# Altium project silovaya_SAUVC26.PrjPcb
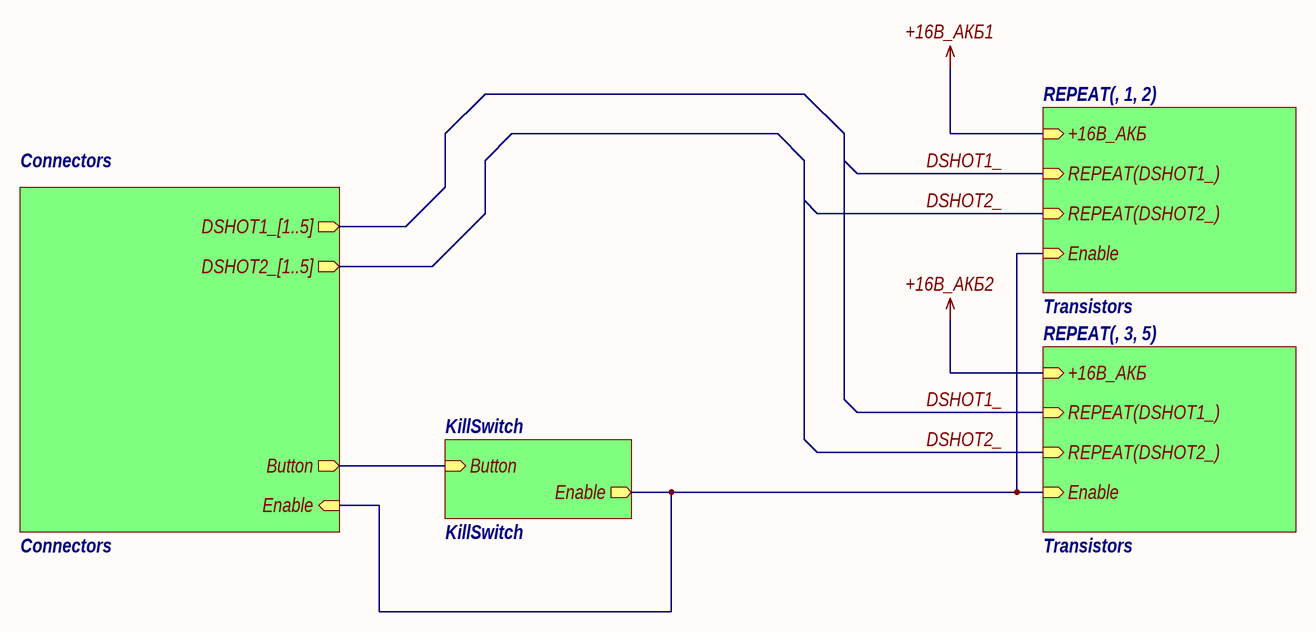
[diagram p0: Main.SchDoc]
4 sheets, 93 parts. Net scope: hierarchical (ports join the sheet entries above them; power ports are global).
Board file: Powerboard_SAUVC26.PcbDoc
Sheets:
  Main.SchDoc
    Connectors = Connectors.SchDoc
    KillSwitch = KillSwitch.SchDoc
    1 = Transistors.SchDoc
    2 = Transistors.SchDoc
    3 = Transistors.SchDoc
    4 = Transistors.SchDoc
    5 = Transistors.SchDoc

## Sheet Main.SchDoc
size 420 x 297 mm; SheetNumber: 1; SheetTotal: 4

### Sub-sheets
Connectors = Connectors: DSHOT1_[1..5] (out), DSHOT2_[1..5] (out), Button (out), Enable (in)
KillSwitch = KillSwitch: Button (in), Enable (out)
REPEAT(, 1, 2) = Transistors: REPEAT(DSHOT1_) (in), REPEAT(DSHOT2_) (in), Enable (in), +16В_АКБ (in)
REPEAT(, 3, 5) = Transistors: REPEAT(DSHOT1_) (in), REPEAT(DSHOT2_) (in), Enable (in), +16В_АКБ (in)

### Nets
Button: sheet Connectors/Button, sheet KillSwitch/Button
DSHOT1_: sheet REPEAT(, 1, 2)/REPEAT(DSHOT1_), sheet REPEAT(, 3, 5)/REPEAT(DSHOT1_)
DSHOT2_: sheet REPEAT(, 1, 2)/REPEAT(DSHOT2_), sheet REPEAT(, 3, 5)/REPEAT(DSHOT2_)
ENABLE: sheet Connectors/Enable, sheet KillSwitch/Enable, sheet REPEAT(, 1, 2)/Enable, sheet REPEAT(, 3, 5)/Enable

### Notes on the sheet
- Перв. примен.
- Справ. №
- Подп. и дата
- Инв. № дубл.
- Взам. инв. №
- Разраб.
- Изм.
- Лист
- № докум.
- Подп.
- Дата
- Лит.
- Масса
- Масштаб
- Пров.
- Т.контр.
- Схема электрическая принципиальная
- Листов
- Инв. № подл.
- Утв.
- Н.контр.
- Копировал
- Формат А3

## Sheet Connectors.SchDoc
size 594 x 420 mm; SheetNumber: 2; SheetTotal: 4
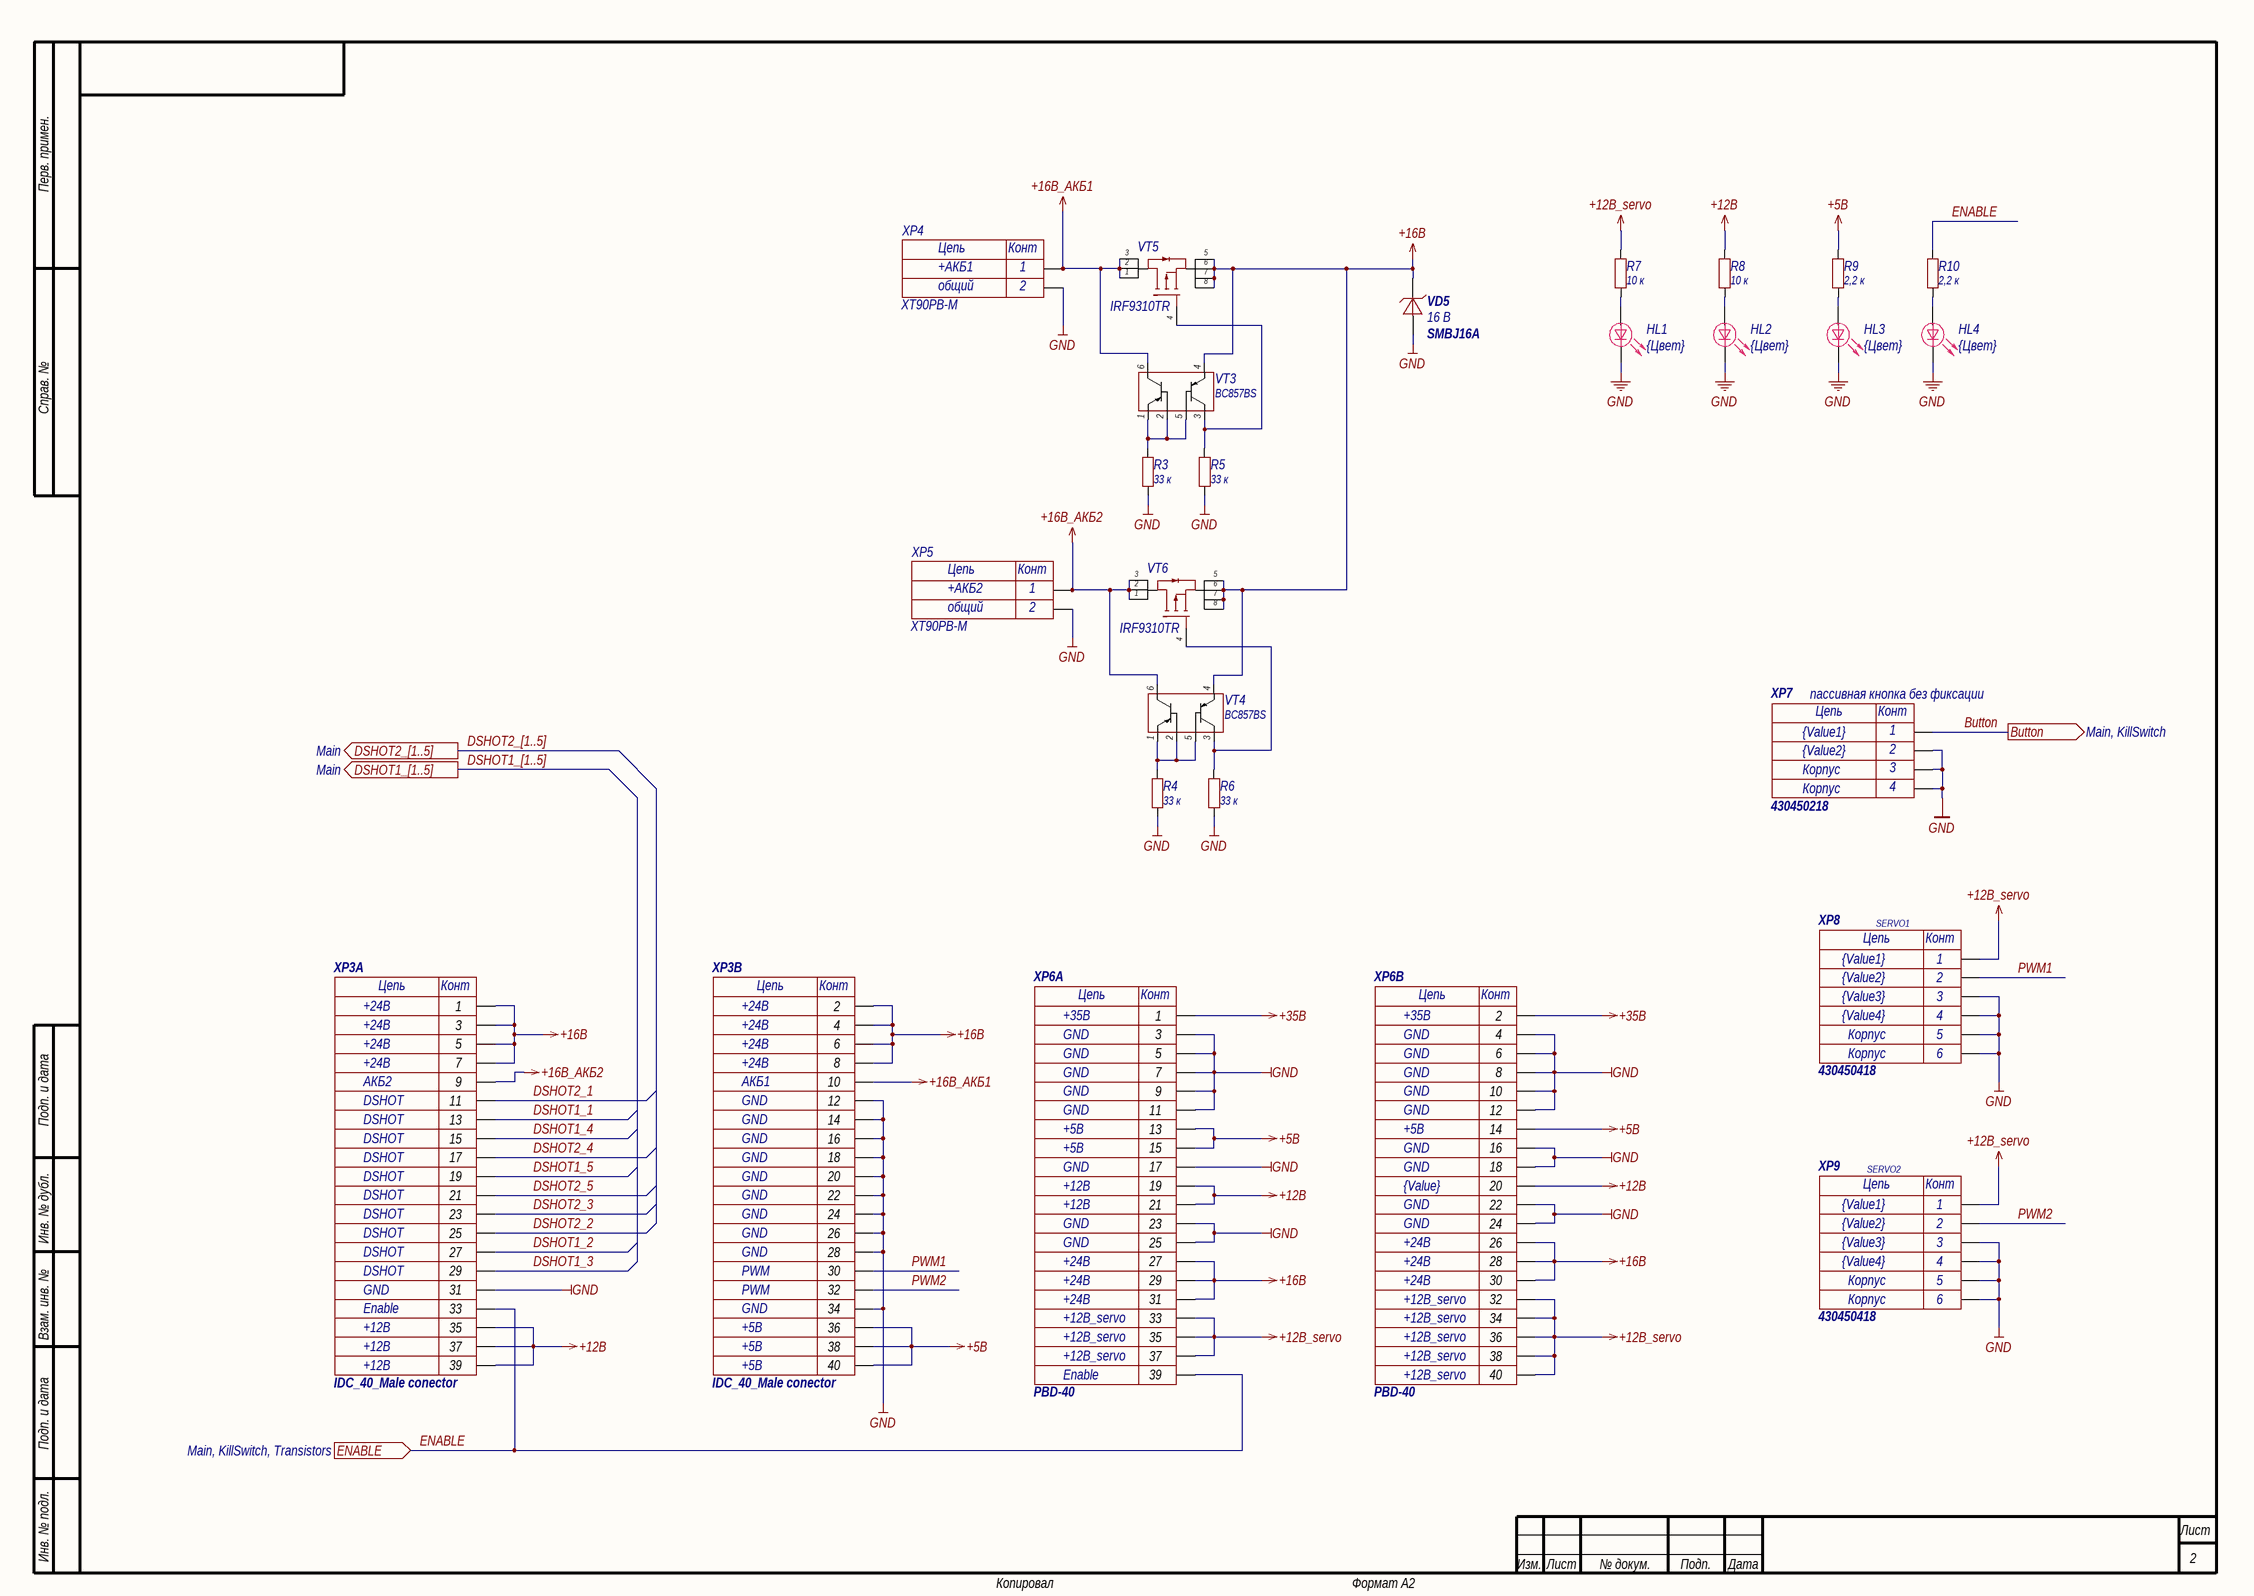
[diagram p1: Connectors.SchDoc]

### Parts
HL1  Color: {Цвет}  [0805D]  (hidden comment: LED)
HL2  Color: {Цвет}  [0805D]  (hidden comment: LED)
HL3  Color: {Цвет}  [0805D]  (hidden comment: LED)
HL4  Color: {Цвет}  [0805D]  (hidden comment: LED)
R3  value 33 к  [0603R]  (hidden comment: Resistor)
R4  value 33 к  [0603R]  (hidden comment: Resistor)
R5  value 33 к  [0603R]  (hidden comment: Resistor)
R6  value 33 к  [0603R]  (hidden comment: Resistor)
R7  value 10 к  [0603R]  (hidden comment: Resistor)
R8  value 10 к  [0603R]  (hidden comment: Resistor)
R9  value 2,2 к  [0603R]  (hidden comment: Resistor)
R10  value 2,2 к  [0603R]  (hidden comment: Resistor)
VD5  SMBJ16A  value 16 В  [SMB]
VT3  BC857BS  [SOT-363_35um]
VT4  BC857BS  [SOT-363_35um]
VT5  IRF9310TR  [SOIC-8]
VT6  IRF9310TR  [SOIC-8]
XP3  IDC_40_Male conector  Value17: Enable  Value20: +12В  Value16: GND  Value15: DSHOT  Value5: АКБ2  Value1: +24В  [IDC_40_Male conector]  (parts A,B of 2)
XP4  XT90PB-M  Value2: общий  Value1: +АКБ1  [XT90PB-M]
XP5  XT90PB-M  Value2: общий  Value1: +АКБ2  [XT90PB-M]
XP6  PBD-40  Value17: +12В_servo  Value20: Enable  Value16: +24В  Value13: GND  Value11: +12В  Value8: +5В  Value1: +35В  [DCDC_SAUVC26]  (parts A,B of 2)
XP7  430450218  Value3: Корпус  Value2: {Value2}  Value1: {Value1}  [Molex_430450218]
XP8  430450418  Value1: {Value1}  Value2: {Value2}  Value3: {Value3}  Value4: {Value4}  [MOLEX_430450418]
XP9  430450418  Value1: {Value1}  Value2: {Value2}  Value3: {Value3}  Value4: {Value4}  [MOLEX_430450418]

### Ports
Button (out, see Main, KillSwitch), DSHOT1_[1..5] (out, see Main), DSHOT2_[1..5] (out, see Main), ENABLE (in, see Main, KillSwitch, Transistors)

### Nets
+5В: R9.2 XP3.36 XP3.38 XP3.40 XP6.13 XP6.14 XP6.15
+12В: R8.2 XP3.35 XP3.37 XP3.39 XP6.19 XP6.20 XP6.21
+12В_servo: R7.2 XP6.32 XP6.33 XP6.34 XP6.35 XP6.36 XP6.37 XP6.38 XP6.40 XP8.1 XP9.1
+16В: VD5.2 VT3.4 VT4.4 VT5.5 VT5.6 VT5.7 VT5.8 VT6.5 VT6.6 VT6.7 VT6.8 XP3.1 XP3.2 XP3.3 XP3.4 XP3.5 XP3.6 XP3.7 XP3.8 XP6.26 XP6.27 XP6.28 XP6.29 XP6.30 XP6.31
+16В_АКБ1: VT3.6 VT5.1 VT5.2 VT5.3 XP3.10 XP4.P
+16В_АКБ2: VT4.6 VT6.1 VT6.2 VT6.3 XP3.9 XP5.P
+35В: XP6.1 XP6.2
GND: HL1.2 HL2.2 HL3.2 HL4.2 R3.1 R4.1 R5.1 R6.1 VD5.1 XP3.12 XP3.14 XP3.16 XP3.18 XP3.20 XP3.22 XP3.24 XP3.26 XP3.28 XP3.31 XP3.34 XP4.N XP5.N XP6.3 XP6.4 XP6.5 XP6.6 XP6.7 XP6.8 XP6.9 XP6.10 XP6.11 XP6.12 XP6.16 XP6.17 XP6.18 XP6.22 XP6.23 XP6.24 XP6.25 XP7.0 XP7.2 XP8.0 XP8.3 XP8.4 XP9.0 XP9.3 XP9.4
Button: XP7.1 ; port Button
DSHOT1_1: XP3.13
DSHOT1_2: XP3.27
DSHOT1_3: XP3.29
DSHOT1_4: XP3.15
DSHOT1_5: XP3.19
DSHOT2_1: XP3.11
DSHOT2_2: XP3.25
DSHOT2_3: XP3.23
DSHOT2_4: XP3.17
DSHOT2_5: XP3.21
ENABLE: R10.2 XP3.33 XP6.39 ; port ENABLE
PWM1: XP3.30 XP8.2
PWM2: XP3.32 XP9.2
NetHL1_1: HL1.1 R7.1
NetHL2_1: HL2.1 R8.1
NetHL3_1: HL3.1 R9.1
NetHL4_1: HL4.1 R10.1
NetR3_2: R3.2 VT3.1 VT3.2 VT3.5
NetR4_2: R4.2 VT4.1 VT4.2 VT4.5
NetR5_2: R5.2 VT3.3 VT5.4
NetR6_2: R6.2 VT4.3 VT6.4

### Buses and harness runs
bus DSHOT1_[1..5] = port DSHOT1_[1..5]
bus DSHOT2_[1..5] = port DSHOT2_[1..5]

### Notes on the sheet
- (near XP7) пассивная кнопка без фиксации
- SERVO1
- SERVO2
- Перв. примен.
- Справ. №
- Подп. и дата
- Инв. № дубл.
- Взам. инв. №
- Инв. № подл.
- Изм.
- Лист
- № докум.
- Подп.
- Дата
- Копировал
- Формат А2
- (in symbol DCDC_SAUVC26, part A) Цепь; Конт
- (in symbol DCDC_SAUVC26, part B) Цепь; Конт
- (in symbol IDC_40_Male conector, part A) Цепь; Конт
- (in symbol IDC_40_Male conector, part B) Цепь; Конт
- (in symbol Molex_430450218) Цепь; Конт; 3; 4
- (in symbol Molex_430450418) Цепь; Конт; Корпус; 5; 6
- (in symbol XT90PB-M) Цепь; Конт; 1; 2

### Library data of the parts
HL1-HL4 = LED: Светодиод; Part Number: LED
R3-R6 = Resistor_33k_1_0603: Резистор номиналом 33 кОм и точностью 1%; Power: *; Part Number: Resistor_33k_1_0603; Tolerance: 1%
R7 R8 = Resistor_10k_1_0603: Резистор номиналом 10 кОм и точностью 1%; Power: *; Part Number: Resistor_10k_1_0603; Tolerance: 1%
R9 R10 = Resistor_2.2k_1_0603: Резистор номиналом 2,2 кОм и точностью 1%; Power: *; Part Number: Resistor_2.2k_1_0603; Tolerance: 1%
VD5 = SMBJ16A: Защитный диод на 16 В, рассеиваемая мощность 600 Вт; Voltage nominal (V): 16; Power (W): 600; Автор: glebmih; Part Number: SMBJ16A
VT3 VT4 = BC857BS: Сборка из биполярных транзисторов, 2 pnp, 45 В,  0.1А; Voltage (V): 45 В; Автор: glebmih; Part Number: BC857BS; Current (A): 0.1 А
VT5 VT6 = IRF9310TR: P-канальный MOSFET, 30 В, 20 А; Voltage (V): 30 В; Current (A): 20 А; Автор: glebmih; Part Number: IRF9310TR
XP3 = IDC_40_Male conector: IDC 40-пиновый разъём прямая вилка; System: Connector; Value19: +12В; Value18: +12В; Value14: DSHOT; Value13: DSHOT; Value12: DSHOT; Value11: DSHOT; Value10: DSHOT; Value9: DSHOT; Value8: DSHOT; Value7: DSHOT; Value6: DSHOT; Part Number: IDC_40_Male conector
XP4 XP5 = XT90PB-M: 90 А (60 продолжительно), 2 контакта, прямой отец; System: Connector; Part Number: XT90PB-M
XP6 = DCDC_SAUVC26: Плата DCDC преобрахователей; Value19: +12В_servo; Value18: +12В_servo; Value15: +24В; Value14: +24В; Value12: GND; Value10: +12В; Value9: GND; Value7: +5В; Value6: GND; Value5: GND; Value4: GND; Value3: GND; Value2: GND
XP7 = Molex_430450218: Разъем типа провод-плата, 3 мм, 2 контакт(-ов), Штыревой Разъем, Серия Micro-Fit для поверхностного монтажа; System: Connector; Value4: Корпус; Part Number: Molex_430450218
XP8 XP9 = Molex_430450418: Разъем типа провод-плата, 3 мм, 4 контакт(-ов), Штыревой Разъем, для поверностного монтажа; System: Connector; Part Number: Molex_430450418

## Sheet KillSwitch.SchDoc
size 420 x 297 mm; SheetNumber: 4; SheetTotal: 4
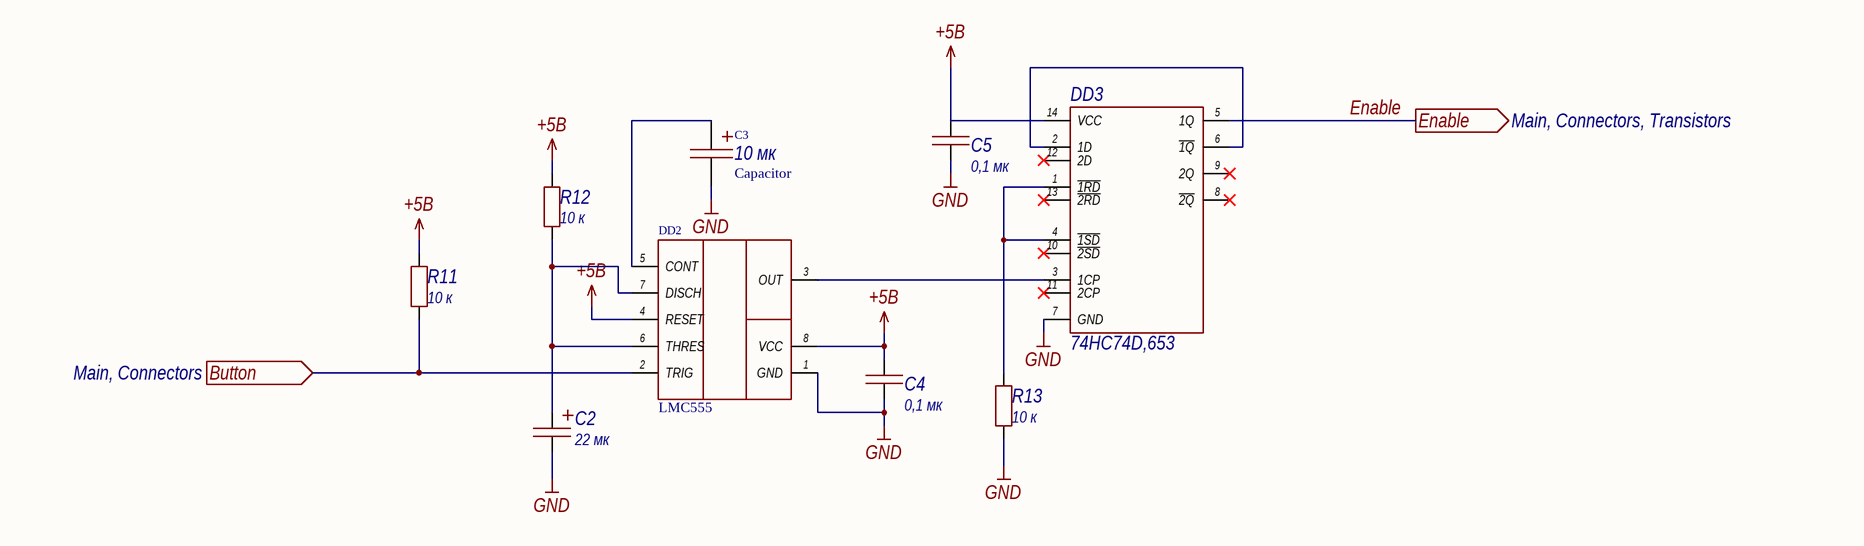
[diagram p2: KillSwitch.SchDoc]

### Parts
C2  value 22 мк  [TC_A]  (hidden comment: Capacitor)
C3  Capacitor  value 10 мк  [TC_A]
C4  value 0,1 мк  [0603C]  (hidden comment: Capacitor)
C5  value 0,1 мк  [0603C]  (hidden comment: Capacitor)
DD2  LMC555  [SOIC-8]
DD3  74HC74D,653  [SOIC-14]
R11  value 10 к  [0603R]  (hidden comment: Resistor)
R12  value 10 к  [0603R]  (hidden comment: Resistor)
R13  value 10 к  [0603R]  (hidden comment: Resistor)

### Ports
Button (in, see Main, Connectors), Enable (out, see Main, Connectors, Transistors)

### Nets
+5В: C4.2 C5.1 DD2.4(RESET) DD2.8(VCC) DD3.14(VCC) R11.2 R12.2
GND: C2.2 C3.2 C4.1 C5.2 DD2.1(GND) DD3.7(GND) R13.1
Button: DD2.2(TRIG) R11.1 ; port Button
ENABLE: DD3.5(1Q) ; port Enable
NetC2_1: C2.1 DD2.6(THRES) DD2.7(DISCH) R12.1
NetC3_1: C3.1 DD2.5(CONT)
NetDD2_3: DD2.3(OUT) DD3.3(1CP)
NetDD3_1: DD3.1(~{1RD}) DD3.4(~{1SD}) R13.2
NetDD3_2: DD3.2(1D) DD3.6(~{1Q})

Not connected (* = marked no-connect by the designer): DD3 8(~{2Q})* 9(2Q)* 10(~{2SD})* 11(2CP)* 12(2D)* 13(~{2RD})*

### Notes on the sheet
- Перв. примен.
- Справ. №
- Подп. и дата
- Инв. № дубл.
- Взам. инв. №
- Инв. № подл.
- Изм.
- Лист
- № докум.
- Подп.
- Дата
- Копировал
- Формат А3

### Library data of the parts
C2 = Capacitor_22u_10_50V_TC_A: Танталовый конденсатор; Tolerance: 0,1; Voltage (V): 50; Type: Tantalum; Capacity (uF): 22; Part Number: Capacitor_22u_10_50V_TC_A
C3 = Capacitor_10u_10_50V_TC_A: Танталовый конденсатор; Tolerance: 0,1; Voltage (V): 50; Type: Tantalum; Capacity (uF): 10; Part Number: Capacitor_10u_10_50V_TC_A
C4 C5 = Capacitor_0,1u_10_50V_X7R_0603C: Конденсатор; Library Path2: Schematic\Capacitor.SchLib; Tolerance: 0,1; Voltage (V): 50; Dielectric: X7R; Capacity (nF): 100; Part Number: Capacitor_0,1u_10_50V_X7R_0603C
DD2 = LMC555: Таймер интегральный прецизионный КМОП; Part Number: LMC555
DD3 = 74HC74D,653: Два триггера D-типа; MF: Nexperia USA; SnapEDA_Link: https://www.snapeda.com/parts/74HC74D,653/Nexperia/view-part/?ref=snap; Package: SO14-14 Nexperia USA Inc.; Value: *; MP: 74HC74D,653; Check_prices: https://www.snapeda.com/parts/74HC74D,653/Nexperia/view-part/?ref=eda; Part Number: 74HC74D,653
R11-R13 = Resistor_10k_1_0603: Резистор номиналом 10 кОм и точностью 1%; Power: *; Part Number: Resistor_10k_1_0603; Tolerance: 1%

## Sheet Transistors.SchDoc
size 420 x 297 mm; SheetNumber: 3; SheetTotal: 4
Used 5 times, as channels 1, 2, 3, 4, 5. Parts and nets are listed once, with the designators drawn on the sheet.
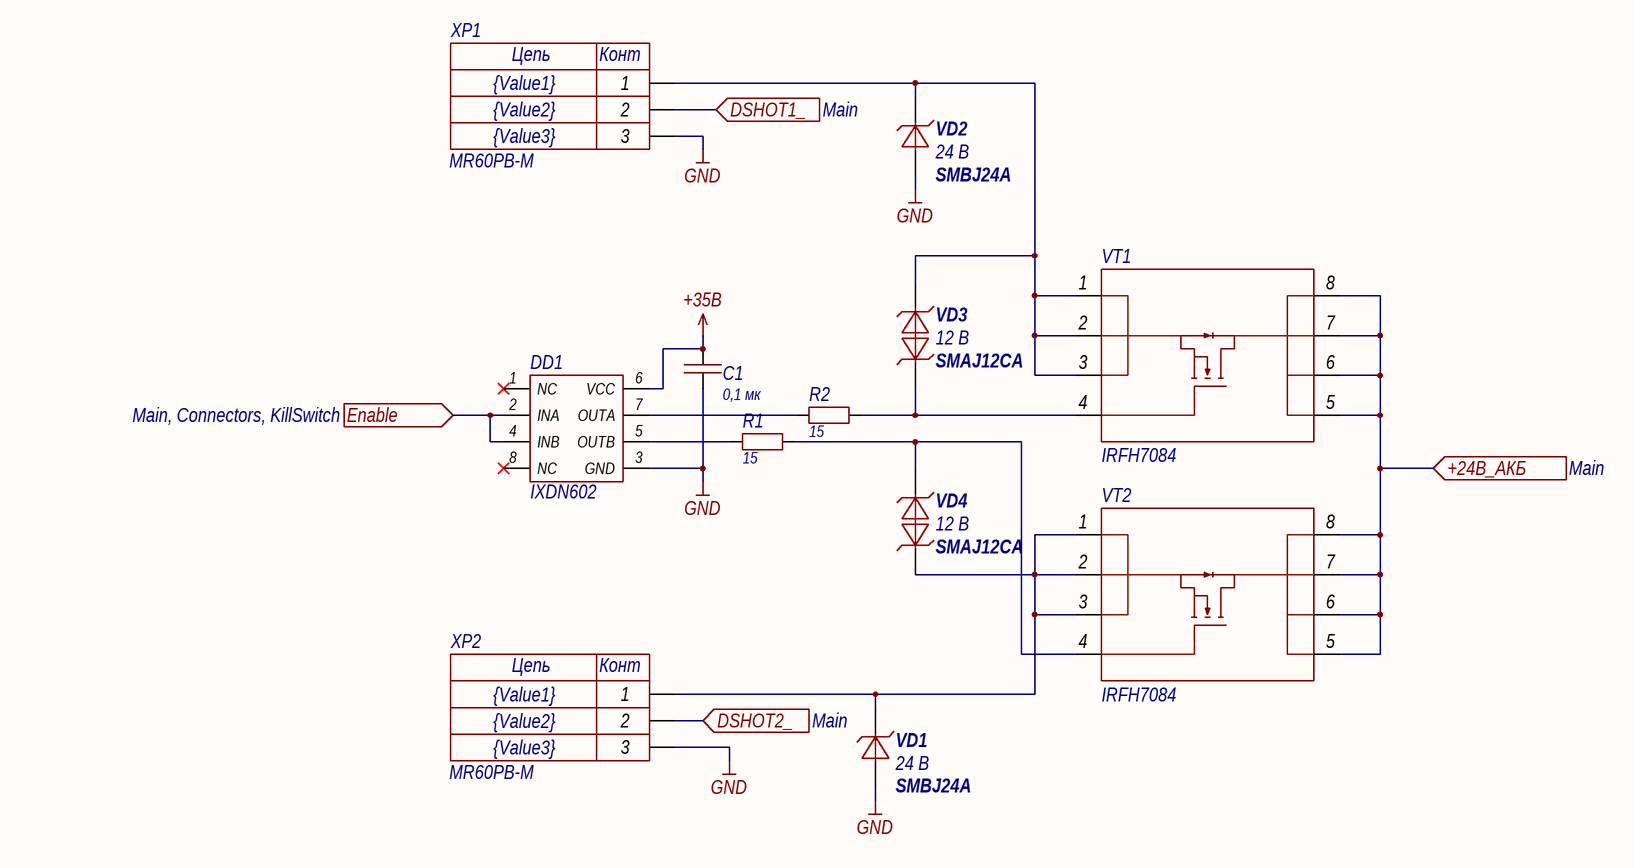
[diagram p3: Transistors.SchDoc]

### Parts
C1  value 0,1 мк  [0603C]  (hidden comment: Capacitor)
DD1  IXDN602  [SOIC-8]
R1  value 15  [0603R]  (hidden comment: Resistor)
R2  value 15  [0603R]  (hidden comment: Resistor)
VD1  SMBJ24A  value 24 В  [SMB]
VD2  SMBJ24A  value 24 В  [SMB]
VD3  SMAJ12CA  value 12 В  [SMA]
VD4  SMAJ12CA  value 12 В  [SMA]
VT1  IRFH7084  [PQFN_5x6]
VT2  IRFH7084  [PQFN_5x6]
XP1  MR60PB-M  Value3: {Value3}  Value2: {Value2}  Value1: {Value1}  [MR60PB-M]
XP2  MR60PB-M  Value3: {Value3}  Value2: {Value2}  Value1: {Value1}  [MR60PB-M]

### Ports
+24В_АКБ (in, see Main), DSHOT1_ (in, see Main), DSHOT2_ (in, see Main), Enable (in, see Main, Connectors, KillSwitch)

### Nets
+35В: C1.2 DD1.6(VCC)
GND: C1.1 DD1.3(GND) VD1.1 VD2.1 XP1.3 XP2.3
+24В_АКБ: VT1.5 VT1.6 VT1.7 VT1.8 VT2.5 VT2.6 VT2.7 VT2.8 ; port +24В_АКБ
DSHOT1_: XP1.2 ; port DSHOT1_
DSHOT2_: XP2.2 ; port DSHOT2_
Enable: DD1.2(INA) DD1.4(INB) ; port Enable
NetDD1_5: DD1.5(OUTB) R1.1
NetDD1_7: DD1.7(OUTA) R2.1
NetR1_2: R1.2 VD4.2 VT2.4
NetR2_2: R2.2 VD3.1 VT1.4
NetVD1_2: VD1.2 VD4.1 VT2.1 VT2.2 VT2.3 XP2.1
NetVD2_2: VD2.2 VD3.2 VT1.1 VT1.2 VT1.3 XP1.1

Not connected (* = marked no-connect by the designer): DD1 1(NC)* 8(NC)*

### Channels
1: designators end in _1; ports +24В_АКБ=NetVT1_1_5 DSHOT1_=DSHOT1_1 DSHOT2_=DSHOT2_1 Enable=ENABLE
2: designators end in _2; ports +24В_АКБ=NetVT1_2_5 DSHOT1_=DSHOT1_2 DSHOT2_=DSHOT2_2 Enable=ENABLE
3: designators end in _3; ports +24В_АКБ=NetVT1_3_5 DSHOT1_=DSHOT1_3 DSHOT2_=DSHOT2_3 Enable=ENABLE
4: designators end in _4; ports +24В_АКБ=NetVT1_4_5 DSHOT1_=DSHOT1_4 DSHOT2_=DSHOT2_4 Enable=ENABLE
5: designators end in _5; ports +24В_АКБ=NetVT1_5_5 DSHOT1_=DSHOT1_5 DSHOT2_=DSHOT2_5 Enable=ENABLE

### Notes on the sheet
- Перв. примен.
- Справ. №
- Подп. и дата
- Инв. № дубл.
- Взам. инв. №
- Инв. № подл.
- Изм.
- Лист
- № докум.
- Подп.
- Дата
- Копировал
- Формат А3
- (in symbol MR60PB-M) Цепь; Конт

### Library data of the parts
C1 = Capacitor_0,1u_10_50V_X7R_0603C: as C4 on sheet KillSwitch; Part Number: Capacitor_0,1u_10_50V_X7R_0603C
DD1 = IXDN602: Двухканальный драйвер затвора для mosfet и igbt транзисторов; Part Number: IXDN602
R1 R2 = Resistor_15_1_0603: Резистор номиналом 15 Ом 1%; Power: *; Part Number: Resistor_15_1_0603; Tolerance: 1%
VD1 VD2 = SMBJ24A: Защитный диод на 24 В, рассеиваемая мощность 600 Вт; Voltage nominal (V): 24; Power (W): 600; Part Number: SMBJ24A
VD3 VD4 = SMAJ12CA: Защитный диод на 12 В, рассеиваемая мощность 400 Вт; Voltage nominal (V): 12; Power (W): 400; Part Number: SMAJ12CA
VT1 VT2 = IRFH7084: N-канальный MOSFET; Напряжение С-И/К-Э: 40 В; Ток макс#: 100 А; Part Number: IRFH7084
XP1 XP2 = MR60PB-M: 60 А (40 продолжительно), 3 контакта, прямой отец; System: Connector; Part Number: MR60PB-M

## Nets that join several sheets
+5В: Connectors (7 pins), KillSwitch (7 pins)
+35В: Connectors (XP6.1 XP6.2), 1 (C1_1.2 DD1_1.6), 2 (C1_2.2 DD1_2.6), 3 (C1_3.2 DD1_3.6), 4 (C1_4.2 DD1_4.6), 5 (C1_5.2 DD1_5.6)
GND: Connectors (47 pins), KillSwitch (7 pins), 1 (6 pins), 2 (6 pins), 3 (6 pins), 4 (6 pins), 5 (6 pins)
Button: Connectors (XP7.1), KillSwitch (DD2.2 R11.1)
ENABLE: Connectors (R10.2 XP3.33 XP6.39), KillSwitch (DD3.5), 1 (DD1_1.2 DD1_1.4), 2 (DD1_2.2 DD1_2.4), 3 (DD1_3.2 DD1_3.4), 4 (DD1_4.2 DD1_4.4), 5 (DD1_5.2 DD1_5.4)